# EAGLE schematic power (EAGLE 6.0)
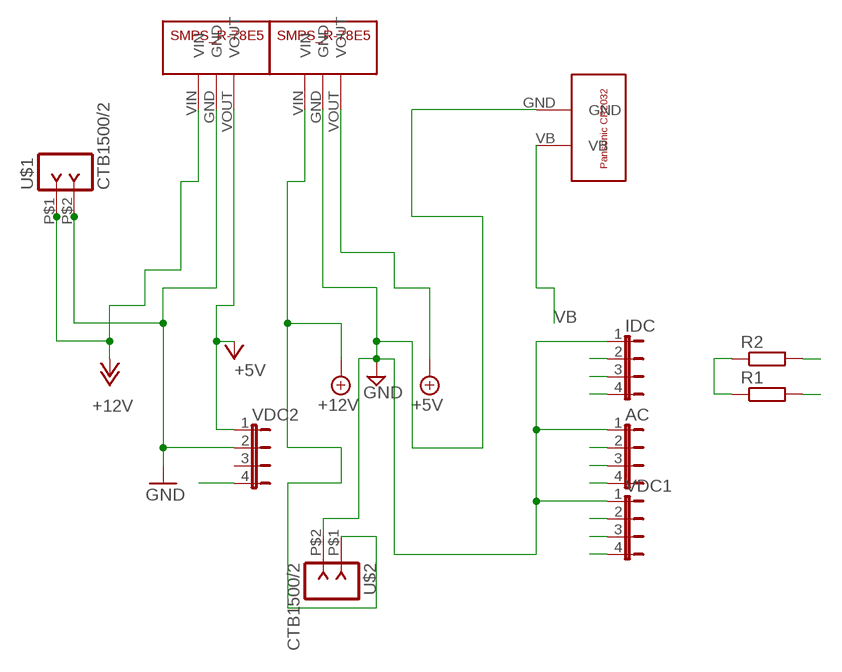
[diagram p0: schematic, sheet 1]

## Parts
AC  JP4E  [JP4]
IDC  JP4E  [JP4]
R1  R-EU_0207/7  [0207/7]
R2  R-EU_0207/7  [0207/7]
U$1  CTB1500/2  [CTB1500-2]
U$2  CTB1500/2  [CTB1500-2]
U$3  PANASONIC_CR2032  [PANASONIC_CR2032]
U$4  SMPS_R-78E5  [SMPS_R-78E5]
U$5  SMPS_R-78E5  [SMPS_R-78E5]
VDC1  JP4E  [JP4]
VDC2  JP4E  [JP4]

## Nets
+5V/1: AC.2 IDC.2 R1.1 R2.1 U$5.VOUT VDC1.2 ; supply symbol labelled +5V
+5V/2: U$4.VOUT VDC2.1 ; supply symbol labelled +5V
+12V/1: U$2.P$1 U$5.VIN ; supply symbol labelled +12V
+12V/2: U$1.P$1 U$4.VIN ; supply symbol labelled +12V
GND1: AC.1 IDC.1 U$2.P$2 U$3.GND U$5.GND VDC1.1 ; supply symbol labelled GND
GND2: U$1.P$2 U$4.GND VDC2.2 ; supply symbol labelled GND
SCL: AC.4 IDC.4 R1.2 VDC1.4
SDA: AC.3 IDC.3 R2.2 VDC1.3
VB: U$3.VB VDC2.4
Unconnected: VDC2.3

## Library data of the parts
AC IDC VDC1 VDC2 = jumper:JP4E: JUMPER
R1 R2 = resistor:R-EU_: RESISTOR, European symbol
U$1 U$2 = eko-parts:CTB1500/2
U$3 = Datalogging_Custom_Parts:PANASONIC_CR2032
U$4 U$5 = Datalogging_Custom_Parts:SMPS_R-78E5